# Altium project AD9116.PrjPcb
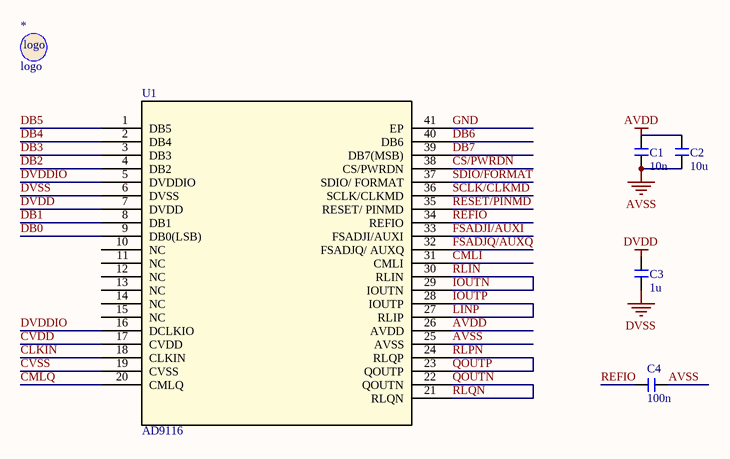
[diagram p0: Sheet1AD9116.SchDoc]
1 sheet, 6 parts. Net scope: global (net labels, ports and power ports of the same name join across sheets).
Board file: PCB1AD9116.PcbDoc

## Sheet Sheet1AD9116.SchDoc
size A4; SheetNumber: 1; SheetTotal: 1

### Parts
*  logo  [HuajingDevices]
C1  10n  [C 0603_L]
C2  10u  [C 0603_L]
C3  1u  [C 0603_L]
C4  100n  [C 0603_L]
U1  AD9116  [CP_40_1_ADI]

### Nets
AVDD: U1.26(AVDD)
AVSS: C1.1 C2.1 C4.1 U1.25(AVSS)
DVDD: U1.7(DVDD)
DVSS: C3.1 U1.6(DVSS)
CLKIN: U1.18(CLKIN)
CMLI: U1.31(CMLI)
CMLQ: U1.20(CMLQ)
CS/PWRDN: U1.38(CS/PWRDN)
CVDD: U1.17(CVDD)
CVSS: U1.19(CVSS)
DB0: U1.9(DB0(LSB))
DB1: U1.8(DB1)
DB2: U1.4(DB2)
DB3: U1.3(DB3)
DB4: U1.2(DB4)
DB5: U1.1(DB5)
DB6: U1.40(DB6)
DB7: U1.39(DB7(MSB))
DVDDIO: U1.5(DVDDIO) U1.16(DCLKIO)
FSADJI/AUXI: U1.33(FSADJI/AUXI)
FSADJQ/AUXQ: U1.32(FSADJQ/_AUXQ)
GND: U1.41(EP)
IOUTN: U1.29(IOUTN) U1.30(RLIN)  [also labelled RLIN]
IOUTP: U1.27(RLIP) U1.28(IOUTP)  [also labelled LINP]
QOUTN: U1.21(RLQN) U1.22(QOUTN)  [also labelled RLQN]
QOUTP: U1.23(QOUTP) U1.24(RLQP)  [also labelled RLPN]
REFIO: C4.2 U1.34(REFIO)
RESET/PINMD: U1.35(RESET/_PINMD)
SCLK/CLKMD: U1.36(SCLK/CLKMD)
SDIO/FORMAT: U1.37(SDIO/_FORMAT)
NetC1_2: C1.2 C2.2

Not connected (* = marked no-connect by the designer): C3 2; U1 10(NC) 11(NC) 12(NC) 13(NC) 14(NC) 15(NC)

### Notes on the sheet
- Labels drawn without touching a wire or pin: AVDD, DVDD

### Library data of the parts
C1-C4 = C: 无极性贴片电容; 版权归属: 源创客; BOM名称: 无极性贴片电容; 学习资源: www.ooocke.com
U1 = AD9116BCPZ: No Description Available; Mfr_Name: Analog Devices Inc; Copyright: Copyright (C) 2022 Ultra Librarian. All rights reserved.; Manufacturer_Part_Number: AD9116BCPZ; RefDes: RefDes; Type: DEV